# EAGLE schematic kosmoc_svf (EAGLE 9.6.2)
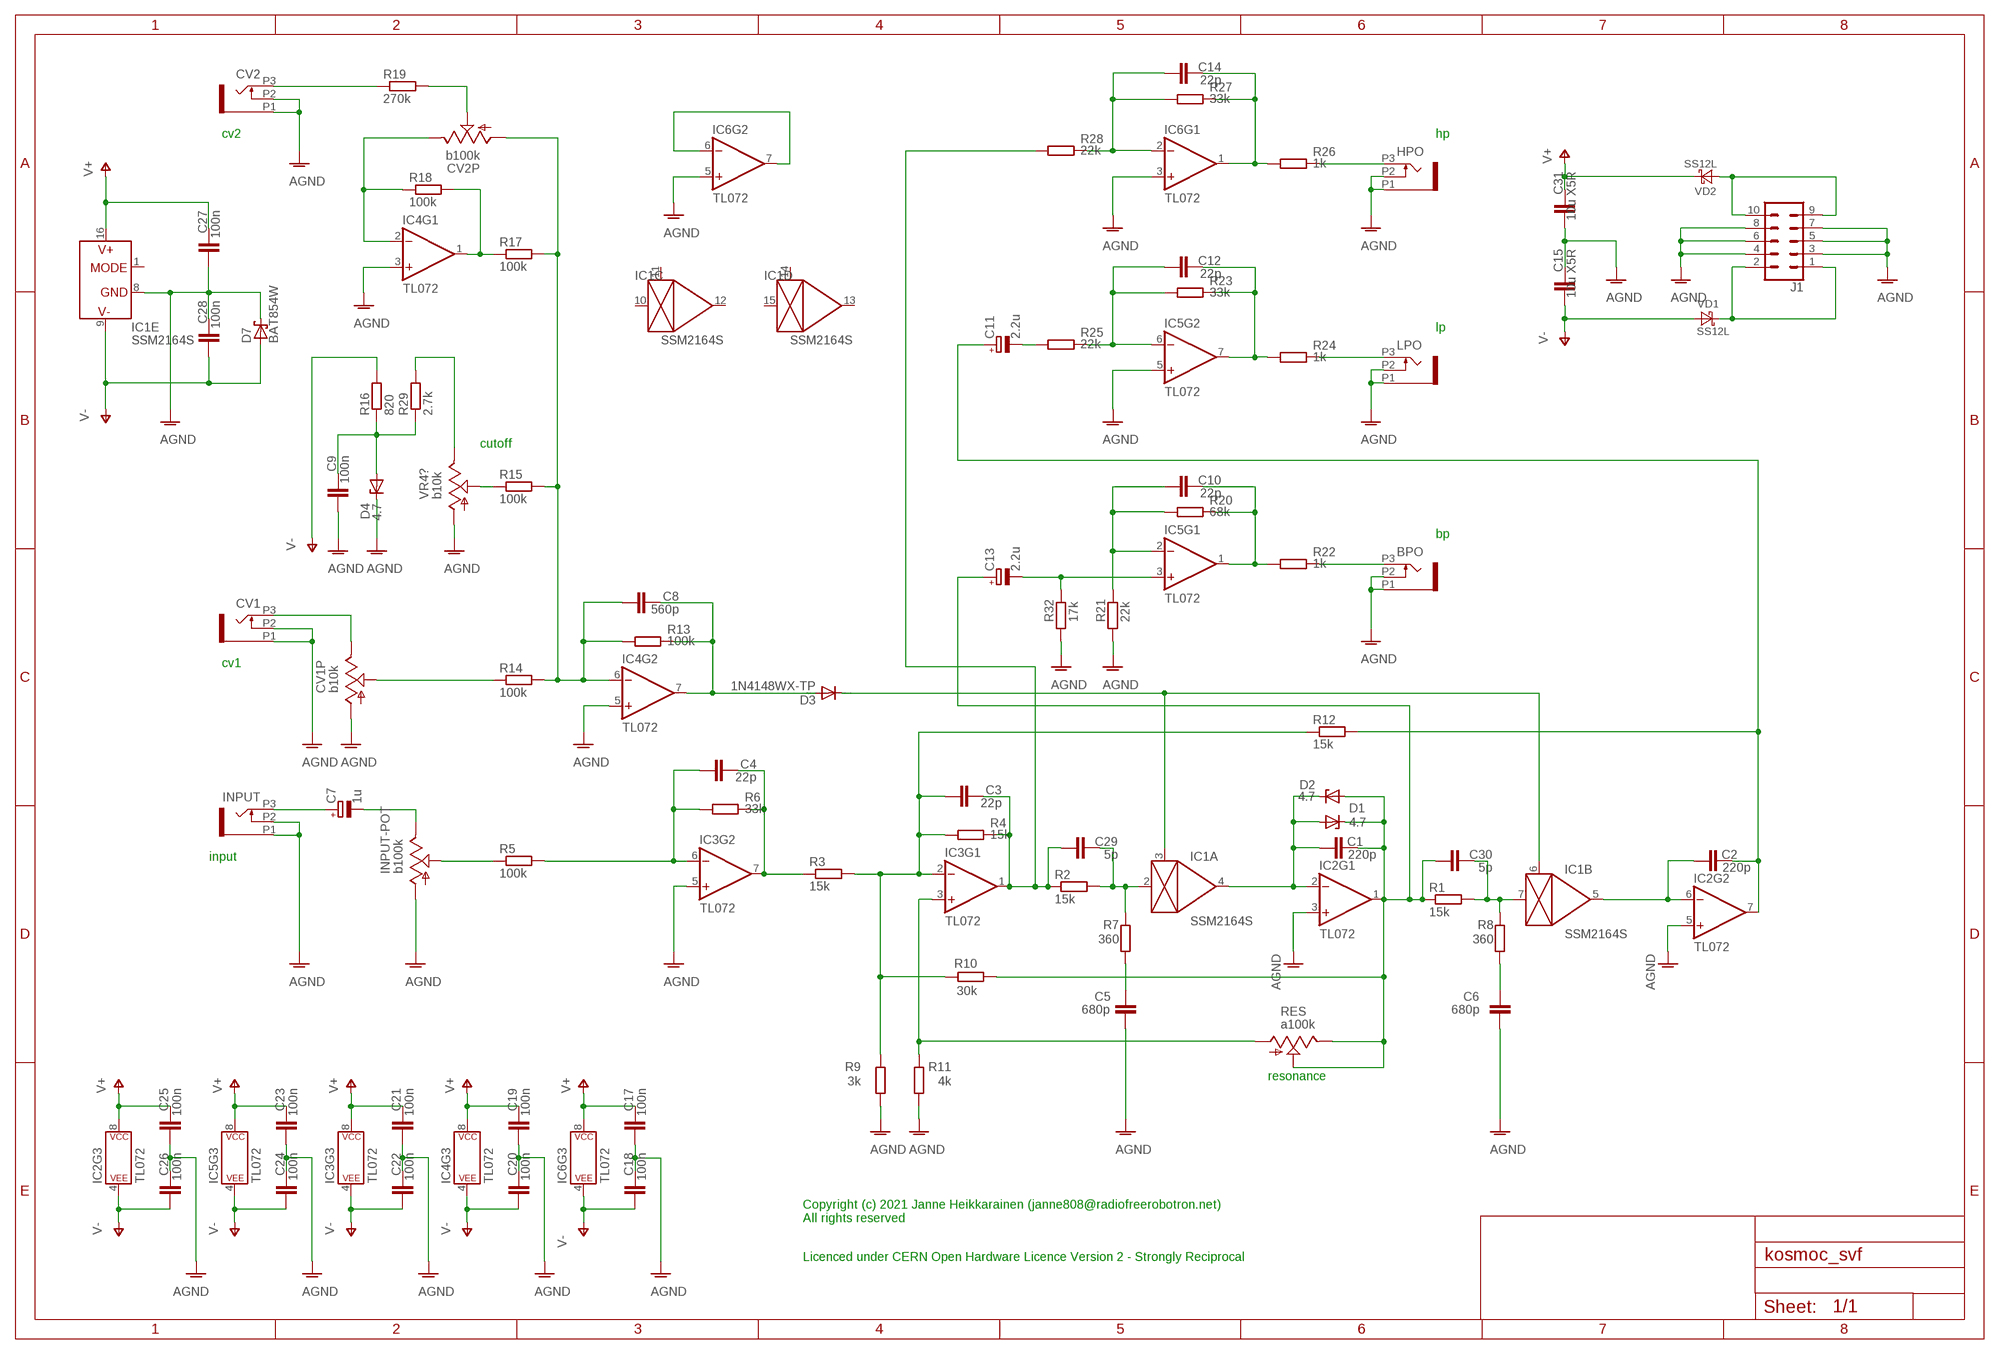
[diagram p0: schematic, sheet 1]

## Parts
BPO  PJ301_THONKICONN6  [WQP_PJ_301M6]
C1  220p  C-EUC0603  [C0603]
C2  220p  C-EUC0603  [C0603]
C3  22p  C-EUC0603  [C0603]
C4  22p  C-EUC0603  [C0603]
C5  680p  C-EUC0603  [C0603]
C6  680p  C-EUC0603  [C0603]
C7  1u  CPOL-EUB  [PANASONIC_B]
C8  560p  C-EUC0603  [C0603]
C9  100n  C-EUC0603  [C0603]
C10  22p  C-EUC0603  [C0603]
C11  2.2u  CPOL-EUB  [PANASONIC_B]
C12  22p  C-EUC0603  [C0603]
C13  2.2u  CPOL-EUB  [PANASONIC_B]
C14  22p  C-EUC0603  [C0603]
C15  10u X5R  C-EUC0805  [C0805]
C17  100n  C-EUC0603  [C0603]
C18  100n  C-EUC0603  [C0603]
C19  100n  C-EUC0603  [C0603]
C20  100n  C-EUC0603  [C0603]
C21  100n  C-EUC0603  [C0603]
C22  100n  C-EUC0603  [C0603]
C23  100n  C-EUC0603  [C0603]
C24  100n  C-EUC0603  [C0603]
C25  100n  C-EUC0603  [C0603]
C26  100n  C-EUC0603  [C0603]
C27  100n  C-EUC0603  [C0603]
C28  100n  C-EUC0603  [C0603]
C29  5p  C-EUC0603  [C0603]
C30  5p  C-EUC0603  [C0603]
C31  10u X5R  C-EUC0805  [C0805]
CV1  PJ301_THONKICONN6  [WQP_PJ_301M6]
CV1P  b10k  POT_USVERTICAL_PS  [ALPS_POT_VERTICAL_PS]
CV2  PJ301_THONKICONN6  [WQP_PJ_301M6]
CV2P  b100k  POT_USVERTICAL_PS  [ALPS_POT_VERTICAL_PS]
D1  4.7  DIODE_ZENER-DIODESOD80C  [DIODE_SOD80C]
D2  4.7  DIODE_ZENER-DIODESOD80C  [DIODE_SOD80C]
D3  1N4148WX-TP  [SOD323R-INFINEON]
D4  4.7  DIODE_ZENER-DIODESOD80C  [DIODE_SOD80C]
D7  BAT854W  1PS70SB10  [SOT323]
HPO  PJ301_THONKICONN6  [WQP_PJ_301M6]
IC1  SSM2164S  [SOIC16N]
IC2  TL072  OPAMP-DUALU  [SO08]
IC3  TL072  OPAMP-DUALU  [SO08]
IC4  TL072  OPAMP-DUALU  [SO08]
IC5  TL072  OPAMP-DUALU  [SO08]
IC6  TL072  OPAMP-DUALU  [SO08]
INPUT  PJ301_THONKICONN6  [WQP_PJ_301M6]
INPUT-POT  b100k  POT_USVERTICAL_PS  [ALPS_POT_VERTICAL_PS]
J1  CONN_05X2SHD  [2X5-SHROUDED]
LPO  PJ301_THONKICONN6  [WQP_PJ_301M6]
R1  15k  R-EU_R0603  [R0603]
R2  15k  R-EU_R0603  [R0603]
R3  15k  R-EU_R0603  [R0603]
R4  15k  R-EU_R0603  [R0603]
R5  100k  R-EU_R0603  [R0603]
R6  33k  R-EU_R0603  [R0603]
R7  360  R-EU_R0603  [R0603]
R8  360  R-EU_R0603  [R0603]
R9  3k  R-EU_R0603  [R0603]
R10  30k  R-EU_R0603  [R0603]
R11  4k  R-EU_R0603  [R0603]
R12  15k  R-EU_R0603  [R0603]
R13  100k  R-EU_R0603  [R0603]
R14  100k  R-EU_R0603  [R0603]
R15  100k  R-EU_R0603  [R0603]
R16  820  R-EU_R0603  [R0603]
R17  100k  R-EU_R0603  [R0603]
R18  100k  R-EU_R0603  [R0603]
R19  270k  R-EU_R0603  [R0603]
R20  68k  R-EU_R0603  [R0603]
R21  22k  R-EU_R0603  [R0603]
R22  1k  R-EU_R0603  [R0603]
R23  33k  R-EU_R0603  [R0603]
R24  1k  R-EU_R0603  [R0603]
R25  22k  R-EU_R0603  [R0603]
R26  1k  R-EU_R0603  [R0603]
R27  33k  R-EU_R0603  [R0603]
R28  22k  R-EU_R0603  [R0603]
R29  2.7k  R-EU_R0603  [R0603]
R32  17k  R-EU_R0603  [R0603]
RES  a100k  POT_USVERTICAL_PS  [ALPS_POT_VERTICAL_PS]
VD1  SS12L  DIODE-SCHOTTKY-SOD123  [SOD123]
VD2  SS12L  DIODE-SCHOTTKY-SOD123  [SOD123]
VR4?  b10k  POT_USVERTICAL_PS  [ALPS_POT_VERTICAL_PS]

## Nets
AGND: BPO.P1 BPO.P2 C5.1 C6.1 C9.1 C15.2 C17.1 C18.2 C19.1 C20.2 C21.1 C22.2 C23.1 C24.2 C25.1 C26.2 C27.1 C28.2 C31.1 CV1.P1 CV1.P2 CV1P.P$3(A) CV2.P1 CV2.P2 D4.C D7.3(K) HPO.P1 HPO.P2 IC1.8(E:GND) IC2.3(+IN) IC2.5(+IN) IC3.5(+IN) IC4.3(+IN) IC4.5(+IN) IC5.5(+IN) IC6.3(+IN) IC6.5(+IN) INPUT-POT.P$3(A) INPUT.P1 INPUT.P2 J1.3 J1.4 J1.5 J1.6 J1.7 J1.8 LPO.P1 LPO.P2 R9.1 R11.1 R21.1 R32.1 VR4?.P$3(A)
N$1: C1.1 D1.A D2.C IC1.4(A:OUT) IC2.2(-IN)
N$2: C2.1 IC1.5(B:OUT) IC2.6(-IN)
N$3: R15.1 VR4?.P$2(S)
N$4: C30.2 IC1.7(B:IN) R1.2 R8.2
N$5: C3.2 C29.1 IC3.1(OUT) R2.1 R4.2 R28.1
N$6: C29.2 IC1.2(A:IN) R2.2 R7.2
N$7: C9.2 D4.A R16.1 R29.1
N$8: C4.2 IC3.7(OUT) R3.1 R6.2
N$9: C3.1 IC3.2(-IN) R3.2 R4.1 R9.2 R10.2 R12.1
N$10: C4.1 IC3.6(-IN) R5.2 R6.1
N$11: R29.2 VR4?.P$1(E)
N$12: C2.2 C11.+ IC2.7(OUT) R12.2
N$13: C7.- INPUT-POT.P$1(E)
N$14: C7.+ INPUT.P3
N$15: C5.2 R7.1
N$16: C6.2 R8.1
N$17: C8.2 D3.A IC4.7(OUT) R13.2
N$18: D3.C IC1.3(A:CTRL) IC1.6(B:CTRL)
N$19: CV1P.P$2(S) R14.1
N$20: INPUT-POT.P$2(S) R5.1
N$21: CV1.P3 CV1P.P$1(E)
N$22: HPO.P3 R26.2
N$23: IC4.1(OUT) R17.1 R18.2
N$24: LPO.P3 R24.2
N$25: BPO.P3 R22.2
N$26: C10.1 IC5.2(-IN) R20.1 R21.2
N$27: CV2.P3 R19.1
N$28: CV2P.P$2(S) R19.2
N$29: C10.2 IC5.1(OUT) R20.2 R22.1
N$30: C13.- IC5.3(+IN) R32.2
N$31: C12.1 IC5.6(-IN) R23.1 R25.2
N$33: C12.2 IC5.7(OUT) R23.2 R24.1
N$34: C11.- R25.1
N$37: IC6.6(-IN) IC6.7(OUT)
N$39: C14.2 IC6.1(OUT) R26.1 R27.2
N$40: C14.1 IC6.2(-IN) R27.1 R28.2
N$42: J1.1 J1.2 VD1.C
N$43: J1.9 J1.10 VD2.A
TO_CV2_POT1: C8.1 CV2P.P$3(A) IC4.6(-IN) R13.1 R14.2 R15.2 R17.2
TO_CV2_POT2: CV2P.P$1(E) IC4.2(-IN) R18.1
TO_RESO_POT1: C1.2 C13.+ C30.1 D1.C D2.A IC2.1(OUT) R1.1 R10.1 RES.P$1(E) RES.P$2(S)
TO_RESO_POT2: IC3.3(+IN) R11.2 RES.P$3(A)
V+: C17.2 C19.2 C21.2 C23.2 C25.2 C27.2 C31.2 IC1.16(E:V+) IC2.8(P$V+) IC3.8(P$V+) IC4.8(P$V+) IC5.8(P$V+) IC6.8(P$V+) VD2.C
V-: C15.1 C18.1 C20.1 C22.1 C24.1 C26.1 C28.1 D7.1(A) IC1.9(E:V-) IC2.4(P$V-) IC3.4(P$V-) IC4.4(P$V-) IC5.4(P$V-) IC6.4(P$V-) R16.2 VD1.A
Unconnected: IC1.1(E:MODE) IC1.10(C:IN) IC1.11(C:CTRL) IC1.12(C:OUT) IC1.13(D:OUT) IC1.14(D:CTRL) IC1.15(D:IN)

## Notes on the sheet
- cv2 | hp
- lp
- cutoff
- bp
- cv1
- input
- resonance
- Copyright (c) 2021 Janne Heikkarainen (janne808@radiofreerobotron.net)
  All rights reserved
- Licenced under CERN Open Hardware Licence Version 2 - Strongly Reciprocal

## Library data of the parts
BPO CV1 CV2 HPO INPUT LPO = og-pj301:PJ301_THONKICONN
C1-C6 C8-C10 C12 C14 C15 C17-C31 = rcl:C-EU: CAPACITOR, European symbol; SPICEPREFIX: C
C7 C11 C13 = rcl:CPOL-EU: POLARIZED CAPACITOR, European symbol; SPICEPREFIX: C
CV1P CV2P INPUT-POT RES VR4? = pot-alps:POT_US
D1 D2 D4 = Diode-SMD:DIODE_ZENER-DIODE: Z-Diode
D3 = Diode-SMD:1N4148WX-TP
D7 = nxp_60:1PS70SB10: Schottky barrier diode Planar Schottky barrier diode encapsulated in a SOT323 very small plastic SMD package. Single diodes and double diodes with different pinning are available. AAL Eindhoven MK
IC1 = ssm2164:SSM2164
IC2-IC6 = SparkFun-IC-Amplifiers:OPAMP-DUAL: Generic op-amp footprint This component is for the standard 358 pinning of a dual op-amp From the LM358 datasheet: Pin 1: Output A Pin 2: Inverting Input A Pin 3: Non-Inverting Input A Pin 4: Gnd Pin 5: Non-Inverting Input B Pin 6: Inverting Input B Pin 7: Output B Pin 8: V+; PROD_ID: NA-XXXXX; VALUE: OP-AMP
J1 = SparkFun-Connectors:CONN_05X2: Multi connection point. Often used as Generic Header-pin footprint for 0.1 inch spaced/style header connections For AVR SPI programming port, see special device with nice symbol: "AVR_SPI_PROG_5x2.dev" You can populate with any combo of single row headers, but if you'd like an exact match, check these: 2x5 AVR ICSP Male Header <https://www.sparkfun.com/products/778> (PRT-00778) 2x5 Pin Shrouded Header <https://www.sparkfun.com/products/8506> (PRT-08506) On any of the 0.1 inch spaced packages, you can populate with these: Break Away Headers - Straight <https://www.sparkfun.com/products/116> (PRT-00116) Break Away Male Headers - Right Angle <https://www.sparkfun.com/products/553> (PRT-00553) Female Headers <https://www.sparkfun.com/products/115> (PRT-00115) Break Away Headers - Machine Pin <https://www.sparkfun.com/products/117> (PRT-00117) Break Away Female Headers - Swiss Machine Pin <https://www.sparkfun.com/products/743> (PRT-00743) Special note: the shrouded connector mates well with our 5x2 ribbon cables: 2x5 Pin IDC Ribbon Cable <https://www.sparkfun.com/products/8535> (PRT-08535); PROD_ID: CONN-08671; SF_ID: PRT-08506
R1-R29 R32 = rcl:R-EU_: RESISTOR, European symbol; SPICEPREFIX: R
VD1 VD2 = diode:DIODE-SCHOTTKY-: SCHOTTKY DIODE